# EAGLE design s_analyzer (EAGLE 7.6.0)
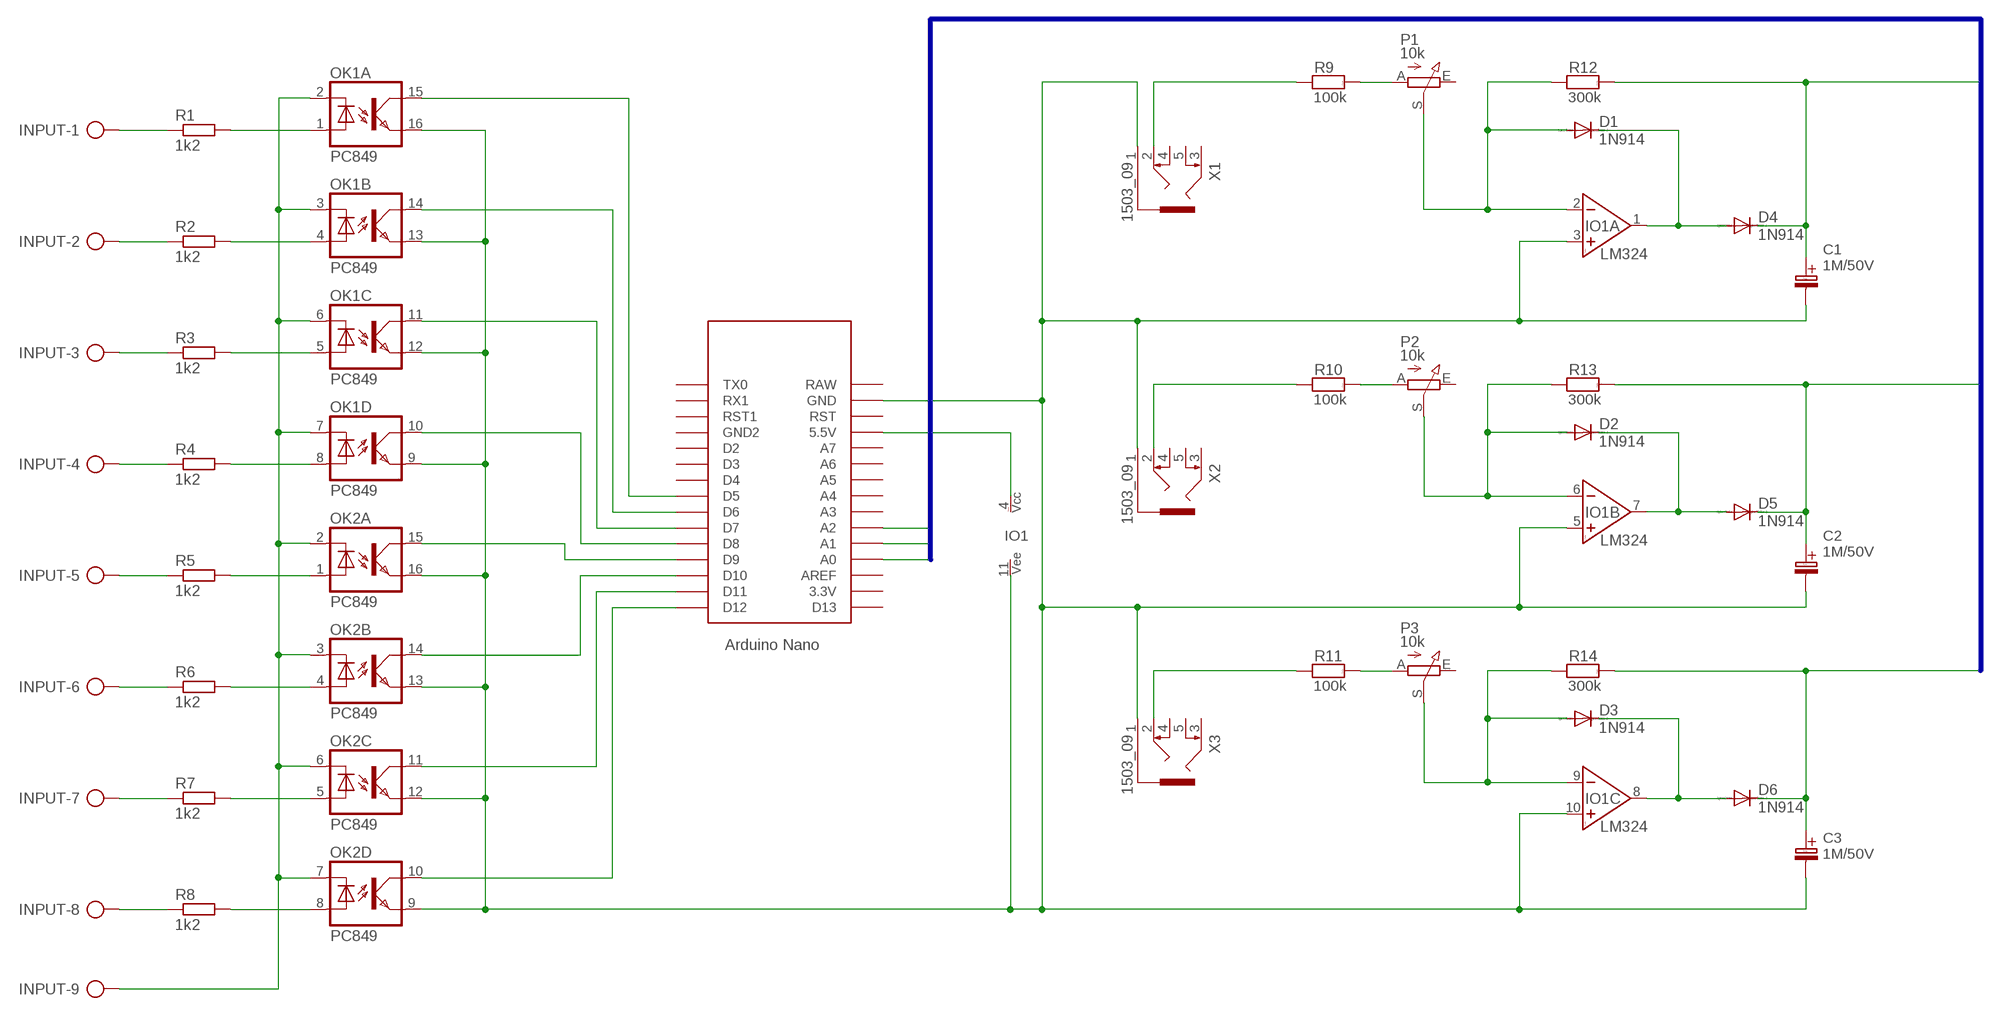
[diagram p0: schematic, sheet 1]

## Parts
C1  1M/50V  [C_EL_2]
C2  1M/50V  [C_EL_2]
C3  1M/50V  [C_EL_2]
D1  1N914  1N4148DO35-7  [DO35-7]
D2  1N914  1N4148DO35-7  [DO35-7]
D3  1N914  1N4148DO35-7  [DO35-7]
D4  1N914  1N4148DO35-7  [DO35-7]
D5  1N914  1N4148DO35-7  [DO35-7]
D6  1N914  1N4148DO35-7  [DO35-7]
INPUT  AK500/9  [AK500/9]
IO1  LM324  [DIL14]
OK1  PC849  [DIL16]
OK2  PC849  [DIL16]
P1  10k  TRIMRPT10V  [PT10V]
P2  10k  TRIMRPT10V  [PT10V]
P3  10k  TRIMRPT10V  [PT10V]
R1  1k2  R-EU_0204/5  [0204/5]
R2  1k2  R-EU_0204/5  [0204/5]
R3  1k2  R-EU_0204/5  [0204/5]
R4  1k2  R-EU_0204/5  [0204/5]
R5  1k2  R-EU_0204/5  [0204/5]
R6  1k2  R-EU_0204/5  [0204/5]
R7  1k2  R-EU_0204/5  [0204/5]
R8  1k2  R-EU_0204/5  [0204/5]
R9  100k  330K  [R_7,5]
R10  100k  330K  [R_7,5]
R11  100k  330K  [R_7,5]
R12  300k  100K  [R_7,5]
R13  300k  100K  [R_7,5]
R14  300k  100K  [R_7,5]
U$1  NANO  [NANO]
X1  1503_09  [1503_09]
X2  1503_09  [1503_09]
X3  1503_09  [1503_09]

## Nets
A0: C1.C+(C_EL+) D4.C R12.2 U$1.A0
A1: C2.C+(C_EL+) D5.C R13.2 U$1.A1
A2: C3.C+(C_EL+) D6.C R14.2 U$1.A2
N$1: INPUT.1 R1.1
N$2: OK1.1(A:A) R1.2
N$3: INPUT.2 R2.1
N$4: OK1.4(B:A) R2.2
N$5: INPUT.3 R3.1
N$6: OK1.5(C:A) R3.2
N$7: INPUT.4 R4.1
N$8: OK1.8(D:A) R4.2
N$9: INPUT.5 R5.1
N$10: OK2.1(A:A) R5.2
N$11: INPUT.6 R6.1
N$12: OK2.4(B:A) R6.2
N$13: INPUT.7 R7.1
N$14: OK2.5(C:A) R7.2
N$15: INPUT.8 R8.1
N$16: OK2.8(D:A) R8.2
N$17: INPUT.9 OK1.2(A:C) OK1.3(B:C) OK1.6(C:C) OK1.7(D:C) OK2.2(A:C) OK2.3(B:C) OK2.6(C:C) OK2.7(D:C)
N$18: IO1.4(POWER:VCC) U$1.5V(5.5V)
N$19: OK2.10(D:COL) U$1.D12
N$20: OK2.11(C:COL) U$1.D11
N$21: OK2.14(B:COL) U$1.D10
N$22: OK2.15(A:COL) U$1.D9
N$23: OK1.10(D:COL) U$1.D8
N$24: OK1.11(C:COL) U$1.D7
N$25: OK1.14(B:COL) U$1.D6
N$26: OK1.15(A:COL) U$1.D5
N$27: D1.A IO1.2(A:IN-) P1.S R12.1
N$28: P1.A R9.2
N$29: D1.C D4.A IO1.1(A:VYSTUP)
N$30: R11.1 X3.2
N$31: P2.A R10.2
N$32: D2.A IO1.6(B:IN-) P2.S R13.1
N$33: D2.C D5.A IO1.7(B:VYSTUP)
N$34: R10.1 X2.2
N$35: P3.A R11.2
N$36: D3.A IO1.9(C:IN-) P3.S R14.1
N$37: D3.C D6.A IO1.8(C:VYSTUP)
N$38: R9.1 X1.2
N$41: C1.C-(C_EL-) C2.C-(C_EL-) C3.C-(C_EL-) IO1.3(A:NEIN+) IO1.5(B:NEIN+) IO1.10(C:NEIN+) IO1.11(POWER:VEE) OK1.9(D:EMI) OK1.12(C:EMI) OK1.13(B:EMI) OK1.16(A:EMI) OK2.9(D:EMI) OK2.12(C:EMI) OK2.13(B:EMI) OK2.16(A:EMI) U$1.GND X1.1 X2.1 X3.1
Unconnected: IO1.12(D:NEIN+) IO1.13(D:IN-) IO1.14(D:VYSTUP) P1.E P2.E P3.E U$1.3.3V U$1.A3 U$1.A4 U$1.A5 U$1.A6 U$1.A7 U$1.AREF U$1.D2 U$1.D3 U$1.D4 U$1.D13 U$1.GND1(GND2) U$1.ICSP1 U$1.ICSP2 U$1.ICSP3 U$1.ICSP4 U$1.ICSP5 U$1.ICSP6 U$1.RAW U$1.RST U$1.RST1 U$1.RX1 U$1.TX0 X1.3 X1.4 X1.5 X2.3 X2.4 X2.5 X3.3 X3.4 X3.5

## Buses
A0,A1,A2

## Library data of the parts
C1-C3 = #PaJa_C-el_2:1M/50V
D1-D6 = diode:1N4148: DIODE high speed (Philips)
INPUT = #Svorkovnice:AK500/9: CONNECTOR
IO1 = #PaJa_31:LM324: OZ - 4x, bipolární
OK1 OK2 = optocoupler:PC849: SHARP OPTO COUPLER; OC_FARNELL: unknown; OC_NEWARK: unknown
P1-P3 = #Trimry:TRIMR
R1-R8 = #Odpory:R-EU_: RESISTOR, European symbol
R9-R11 = #PaJa_R:330K
R12-R14 = #PaJa_R:100K
U$1 = Arduino-clone:NANO: Arduino Nano
X1-X3 = con-lumberg:1503_09: Jack connectors according to JISC 6560, 3.5 mm Klinkeneinbaukupplung nach JISC 6560, 3,5 mm, 3-polig/ stereo, abgewinkelte Ausführung, mit 2 Öffnern und Lötaugen, für Leiterplatten Rückseitenmontage Source: http://www.lumberg.com/Produkte/PDFs/1503_09.pdf; OC_FARNELL: 1243244; OC_NEWARK: unknown

## Board
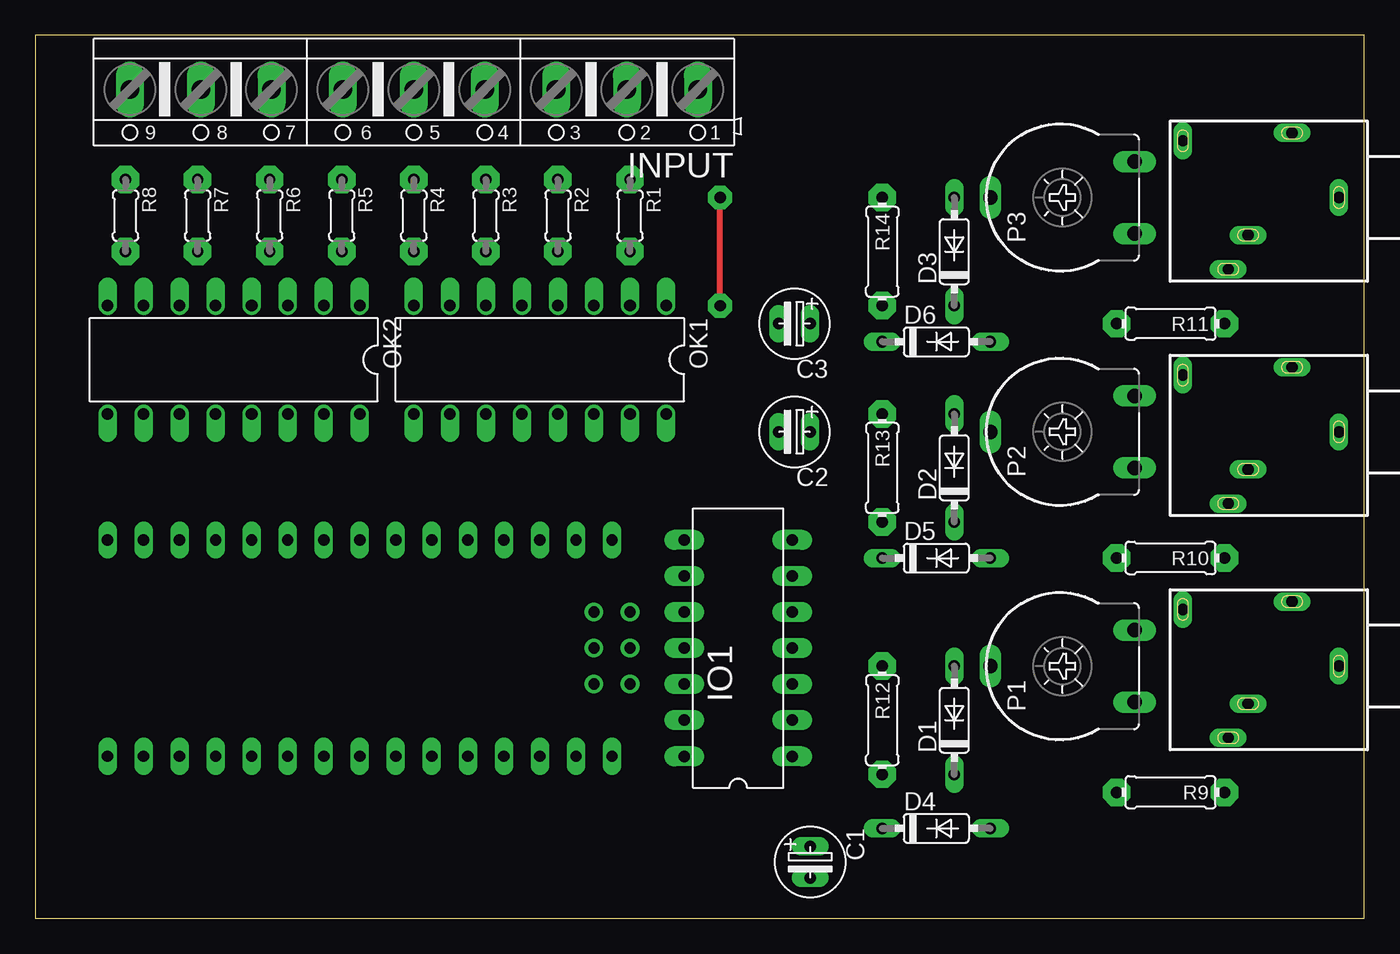
[diagram p1: board, top side]
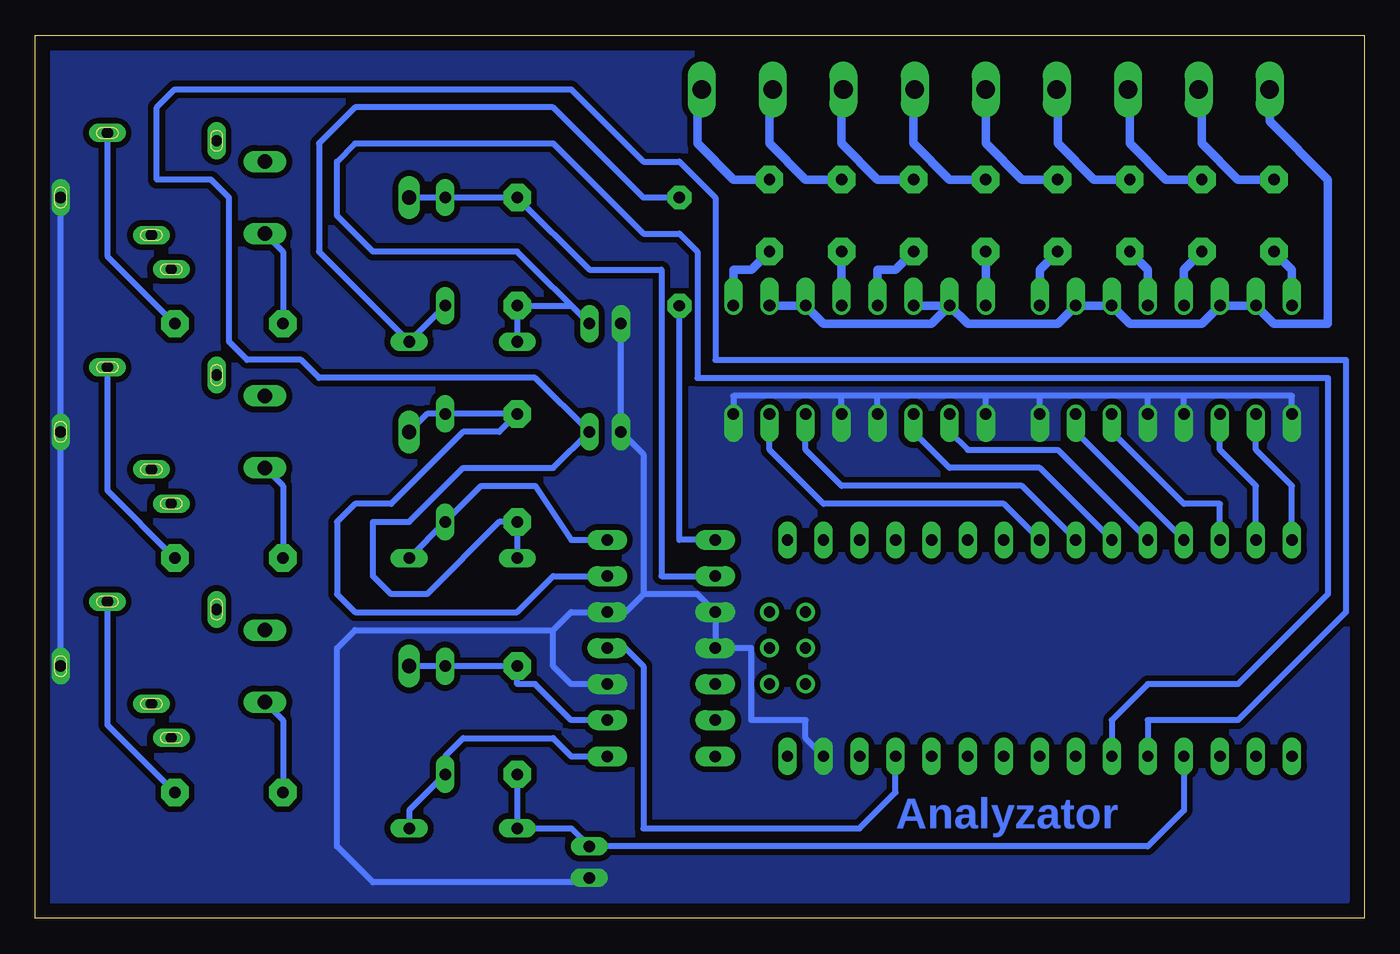
[diagram p2: board, bottom side, seen from below]

Size 93.65 x 62.22 mm. Coordinates in mm from the lower left corner, seen from the top.
Outline: 0,0 93.65,0 93.65,62.22 0,62.22 0,0
Copper layers (1*16): Top 0.035mm / dielectric 1.5mm / Bottom 0.035mm
Design rules "default": minimum track width 10mil, minimum drill 24mil, track to track 8mil, track to pad 8mil, pad to pad 8mil, via to via 8mil, smd to smd 8mil, copper to edge 40mil, drill to drill 8mil, minimum pad ring 10mil, minimum via ring 8mil, stop-mask expansion 4mil, vias tented up to drill 0mil, thermal gap 10mil

### Footprints (pad centres in the part's own frame; a part is rotated, then mirrored left to right if it is on the bottom)
C_EL_2 = drill 0.813 pad 1.27 long: C+ 0,0; C- 2.223,0
DO35-7 = drill 0.813 long: A 3.81,0; C -3.81,0
AK500/9 = drill 1.321 long: 1 -20.015,0; 2 -15.011,0; 3 -10.033,0; 4 -5.004,0; 5 0,0; 6 5.004,0; 7 10.033,0; 8 15.011,0; 9 20.015,0
DIL14 = drill 0.813 pad 1.4 long: 1 -7.62,-3.81; 2 -5.08,-3.81; 3 -2.54,-3.81; 4 0,-3.81; 5 2.54,-3.81; 6 5.08,-3.81; 7 7.62,-3.81; 8 7.62,3.81; 9 5.08,3.81; 10 2.54,3.81; 11 0,3.81; 12 -2.54,3.81; 13 -5.08,3.81; 14 -7.62,3.81
DIL16 = drill 0.813 offset: 1 -8.89,-3.81; 2 -6.35,-3.81; 3 -3.81,-3.81; 4 -1.27,-3.81; 5 1.27,-3.81; 6 3.81,-3.81; 7 6.35,-3.81; 8 8.89,-3.81; 9 8.89,3.81; 10 6.35,3.81; 11 3.81,3.81; 12 1.27,3.81; 13 -1.27,3.81; 14 -3.81,3.81; 15 -6.35,3.81; 16 -8.89,3.81
PT10V = drill 1.016 long: A -2.54,-5.08; E 2.54,-5.08; S 0,5.08
0204/5 = drill 0.8 pad 1.93 octagon: 1 -2.54,0; 2 2.54,0
R_7,5 = drill 0.813 pad 1.93 octagon: 1 -3.81,0; 2 3.81,0
NANO = drill 0.8 long: 3.3V -10.16,24.13; 5V -10.16,-1.27; A0 -10.16,19.05; A1 -10.16,16.51; A2 -10.16,13.97; A3 -10.16,11.43; A4 -10.16,8.89; A5 -10.16,6.35; A6 -10.16,3.81; A7 -10.16,1.27; AREF -10.16,21.59; D2 5.08,1.27; D3 5.08,3.81; D4 5.08,6.35; D5 5.08,8.89; D6 5.08,11.43; D7 5.08,13.97; D8 5.08,16.51; D9 5.08,19.05; D10 5.08,21.59; D11 5.08,24.13; D12 5.08,26.67; D13 -10.16,26.67; GND -10.16,-6.35; GND1 5.08,-1.27; RAW -10.16,-8.89; RST -10.16,-3.81; RST1 5.08,-3.81; RX1 5.08,-6.35; TX0 5.08,-8.89 | drill 0.8: ICSP1 -5.08,-10.16; ICSP2 -5.08,-7.62; ICSP3 -2.54,-10.16; ICSP4 -2.54,-7.62; ICSP5 0,-10.16; ICSP6 0,-7.62
1503_09 = drill 0.8 pad 1.2 long: 1 0,-2.1; 2 -4.55,-5.4; 3 5.05,-9.9; 4 -4,-13.1; 5 2.65,-8.5

### Placement (x,y rotation side)
C1  54.61,5.08 270 top
C2  54.61,34.29 180 top
C3  54.61,41.91 180 top
D1  64.77,13.97 90 top
D2  64.77,31.75 90 top
D3  64.77,46.99 90 top
D4  63.5,6.35 0 top
D5  63.5,25.4 0 top
D6  63.5,40.64 0 top
INPUT  26.67,58.42 180 top
IO1  49.53,19.05 90 top
OK1  35.56,39.37 180 top
OK2  13.97,39.37 180 top
P1  72.39,17.78 90 top
P2  72.39,34.29 90 top
P3  72.39,50.8 90 top
R1  41.91,49.53 270 top
R2  36.83,49.53 270 top
R3  31.75,49.53 270 top
R4  26.67,49.53 270 top
R5  21.59,49.53 270 top
R6  16.51,49.53 270 top
R7  11.43,49.53 270 top
R8  6.35,49.53 270 top
R9  80.01,8.89 180 top
R10  80.01,25.4 180 top
R11  80.01,41.91 180 top
R12  59.69,13.97 270 top
R13  59.69,31.75 270 top
R14  59.69,46.99 270 top
U$1  31.75,21.59 90 top
X1  93.98,17.78 270 top
X2  93.98,34.29 270 top
X3  93.98,50.8 270 top

### Tracks (layer width: path | path; a pad name or v marks a point on that pad's centre or on a via)
A0
  Bottom 0.406: U$1.A0 12.7,7.62 15.24,5.08 C1.C+ 55.88,6.35 D4.C R12.2
A1
  Bottom 0.406: D5.C R13.2 60.96,27.94 66.04,22.86 68.58,22.86 69.85,24.13 69.85,27.94 67.31,27.94 63.5,31.75 57.15,31.75 C2.C+ 58.42,38.1 73.66,38.1 74.93,39.37 78.74,39.37 80.01,40.64 80.01,50.8 81.28,52.07 85.09,52.07 85.09,57.15 83.82,58.42 55.88,58.42 50.8,53.34 48.26,53.34 45.72,50.8 45.72,39.37 1.27,39.37 1.27,21.59 8.89,13.97 15.24,13.97 U$1.A1
A2
  Bottom 0.406: D6.C R14.2 55.88,43.18 C3.C+ 59.69,46.99 69.85,46.99 72.39,49.53 72.39,53.34 71.12,54.61 57.15,54.61 50.8,48.26 48.26,48.26 46.99,46.99 46.99,38.1 2.54,38.1 2.54,22.86 8.89,16.51 15.24,16.51 17.78,13.97 U$1.A2
N$1
  Bottom 0.61: R1.1 44.45,52.07 46.99,54.61 46.99,58.12
  Bottom 0.813: 46.99,58.12 INPUT.1
N$2
  Bottom 0.61: R1.2 43.18,45.72 44.45,45.72 OK1.1
N$3
  Bottom 0.61: R2.1 39.37,52.07 41.91,54.61 41.91,58.19
  Bottom 0.813: 41.91,58.19 INPUT.2
N$4
  Bottom 0.61: R2.2 OK1.4
N$5
  Bottom 0.61: R3.1 34.29,52.07 36.83,54.61 36.83,58.29
  Bottom 0.813: 36.83,58.29 INPUT.3
N$6
  Bottom 0.61: R3.2 33.02,45.72 34.29,45.72 OK1.5
N$7
  Bottom 0.61: R4.1 29.21,52.07 31.75,54.61 31.75,58.34
  Bottom 0.813: 31.75,58.34 INPUT.4
N$8
  Bottom 0.61: R4.2 OK1.8
N$9
  Bottom 0.61: R5.1 24.13,52.07 26.67,54.61 INPUT.5
N$10
  Bottom 0.61: R5.2 22.86,45.72 OK2.1
N$11
  Bottom 0.61: R6.1 19.05,52.07 21.59,54.61 21.59,58.34
  Bottom 0.813: 21.59,58.34 INPUT.6
N$12
  Bottom 0.61: R6.2 15.24,45.72 OK2.4
N$13
  Bottom 0.61: R7.1 13.97,52.07 16.51,54.61 16.51,58.29
  Bottom 0.813: 16.51,58.29 INPUT.7
N$14
  Bottom 0.61: R7.2 12.7,45.72 OK2.5
N$15
  Bottom 0.61: R8.1 8.89,52.07 11.43,54.61 11.43,58.19
  Bottom 0.813: 11.43,58.19 INPUT.8
N$16
  Bottom 0.61: R8.2 5.08,45.72 OK2.8
N$17
  Bottom 0.61: OK1.2 OK1.3 38.1,41.91 30.48,41.91 OK1.7 | OK1.6 OK1.7 | OK1.7 27.94,41.91 21.59,41.91 OK2.2 OK2.3 16.51,41.91 11.43,41.91 OK2.6 OK2.7 6.35,41.91 2.54,41.91 2.54,52.07 6.65,56.18 INPUT.9
N$18
  Bottom 0.406: IO1.4 52.07,19.05 50.8,17.78 50.8,6.35 35.56,6.35 33.02,8.89 U$1.5V
N$19
  Bottom 0.406: U$1.D12 5.08,30.48 7.62,33.02 OK2.10
N$20
  Bottom 0.406: U$1.D11 7.62,30.48 10.16,33.02 OK2.11
N$21
  Bottom 0.406: U$1.D10 10.16,29.21 12.7,29.21 17.78,34.29 OK2.14
N$22
  Bottom 0.406: U$1.D9 20.32,34.29 OK2.15
N$23
  Bottom 0.406: OK1.10 29.21,34.29 27.94,33.02 21.59,33.02 U$1.D8
N$24
  Bottom 0.406: U$1.D7 22.86,31.75 29.21,31.75 31.75,34.29 OK1.11
N$25
  Bottom 0.406: U$1.D6 24.13,30.48 36.83,30.48 39.37,33.02 OK1.14
N$26
  Bottom 0.406: U$1.D5 25.4,29.21 38.1,29.21 41.91,33.02 OK1.15
N$27
  Bottom 0.406: P1.S D1.A R12.1 59.69,16.51 58.42,16.51 55.88,13.97 IO1.2
N$28
  Bottom 0.406: P1.A 76.2,13.97 R9.2
N$29
  Bottom 0.406: IO1.1 55.88,11.43 57.15,12.7 63.5,12.7 64.77,11.43 D1.C 67.31,7.62 D4.A
N$30
  Bottom 0.406: X3.2 88.58,46.67 R11.1
N$31
  Bottom 0.406: P2.A 76.2,30.48 R10.2
N$32
  Bottom 0.406: P2.S 66.04,35.56 D2.A R13.1 60.96,34.29 63.5,34.29 68.58,29.21 71.12,29.21 72.39,27.94 72.39,22.86 71.12,21.59 59.69,21.59 57.15,24.13 IO1.6
N$33
  Bottom 0.406: D5.A D2.C 62.23,30.48 58.42,30.48 55.88,26.67 IO1.7
N$34
  Bottom 0.406: X2.2 88.58,30.16 R10.1
N$35
  Bottom 0.406: P3.A 76.2,46.99 R11.2
N$36
  Bottom 0.406: P3.S D3.A R14.1 54.61,45.72 49.53,45.72 49.53,24.13 IO1.9
N$37  (via drill 0.8 pad 1.68)
  Top 0.406: v48.26,43.18 v48.26,50.8
  Bottom 0.406: D3.C D6.A 73.66,46.99 73.66,54.61 71.12,57.15 57.15,57.15 50.8,50.8 v48.26,50.8 | IO1.8 48.26,26.67 v48.26,43.18
N$38
  Bottom 0.406: X1.2 88.58,13.65 R9.1
N$41
  Bottom 0.406: OK2.9 5.08,36.83 12.7,36.83 | OK2.12 12.7,36.83 | 12.7,36.83 15.24,36.83 | OK2.13 15.24,36.83 | 15.24,36.83 22.86,36.83 | OK2.16 22.86,36.83 | 22.86,36.83 26.67,36.83 | OK1.9 26.67,36.83 | 26.67,36.83 34.29,36.83 | OK1.12 34.29,36.83 | 34.29,36.83 36.83,36.83 | OK1.13 36.83,36.83 | 36.83,36.83 44.45,36.83 OK1.16 | X1.1 X2.1 X3.1 | 57.15,20.32 71.12,20.32 72.39,19.05 72.39,5.08 69.85,2.54 54.61,2.54 C1.C- | 57.15,20.32 55.88,21.59 IO1.5 52.07,21.59 50.8,22.86 | IO1.3 55.88,16.51 57.15,17.78 57.15,20.32 | 50.8,22.86 50.8,32.7 C2.C- C3.C- | 50.8,22.86 46.99,22.86 IO1.10 IO1.11 43.18,19.05 43.18,13.97 39.37,13.97 39.37,12.7 U$1.GND
  pour Bottom (isolate 0.406, no thermals): 92.71,60.96 92.71,1.27 1.27,1.27 1.27,60.96

### Text on the board
Bottom: Analyzator